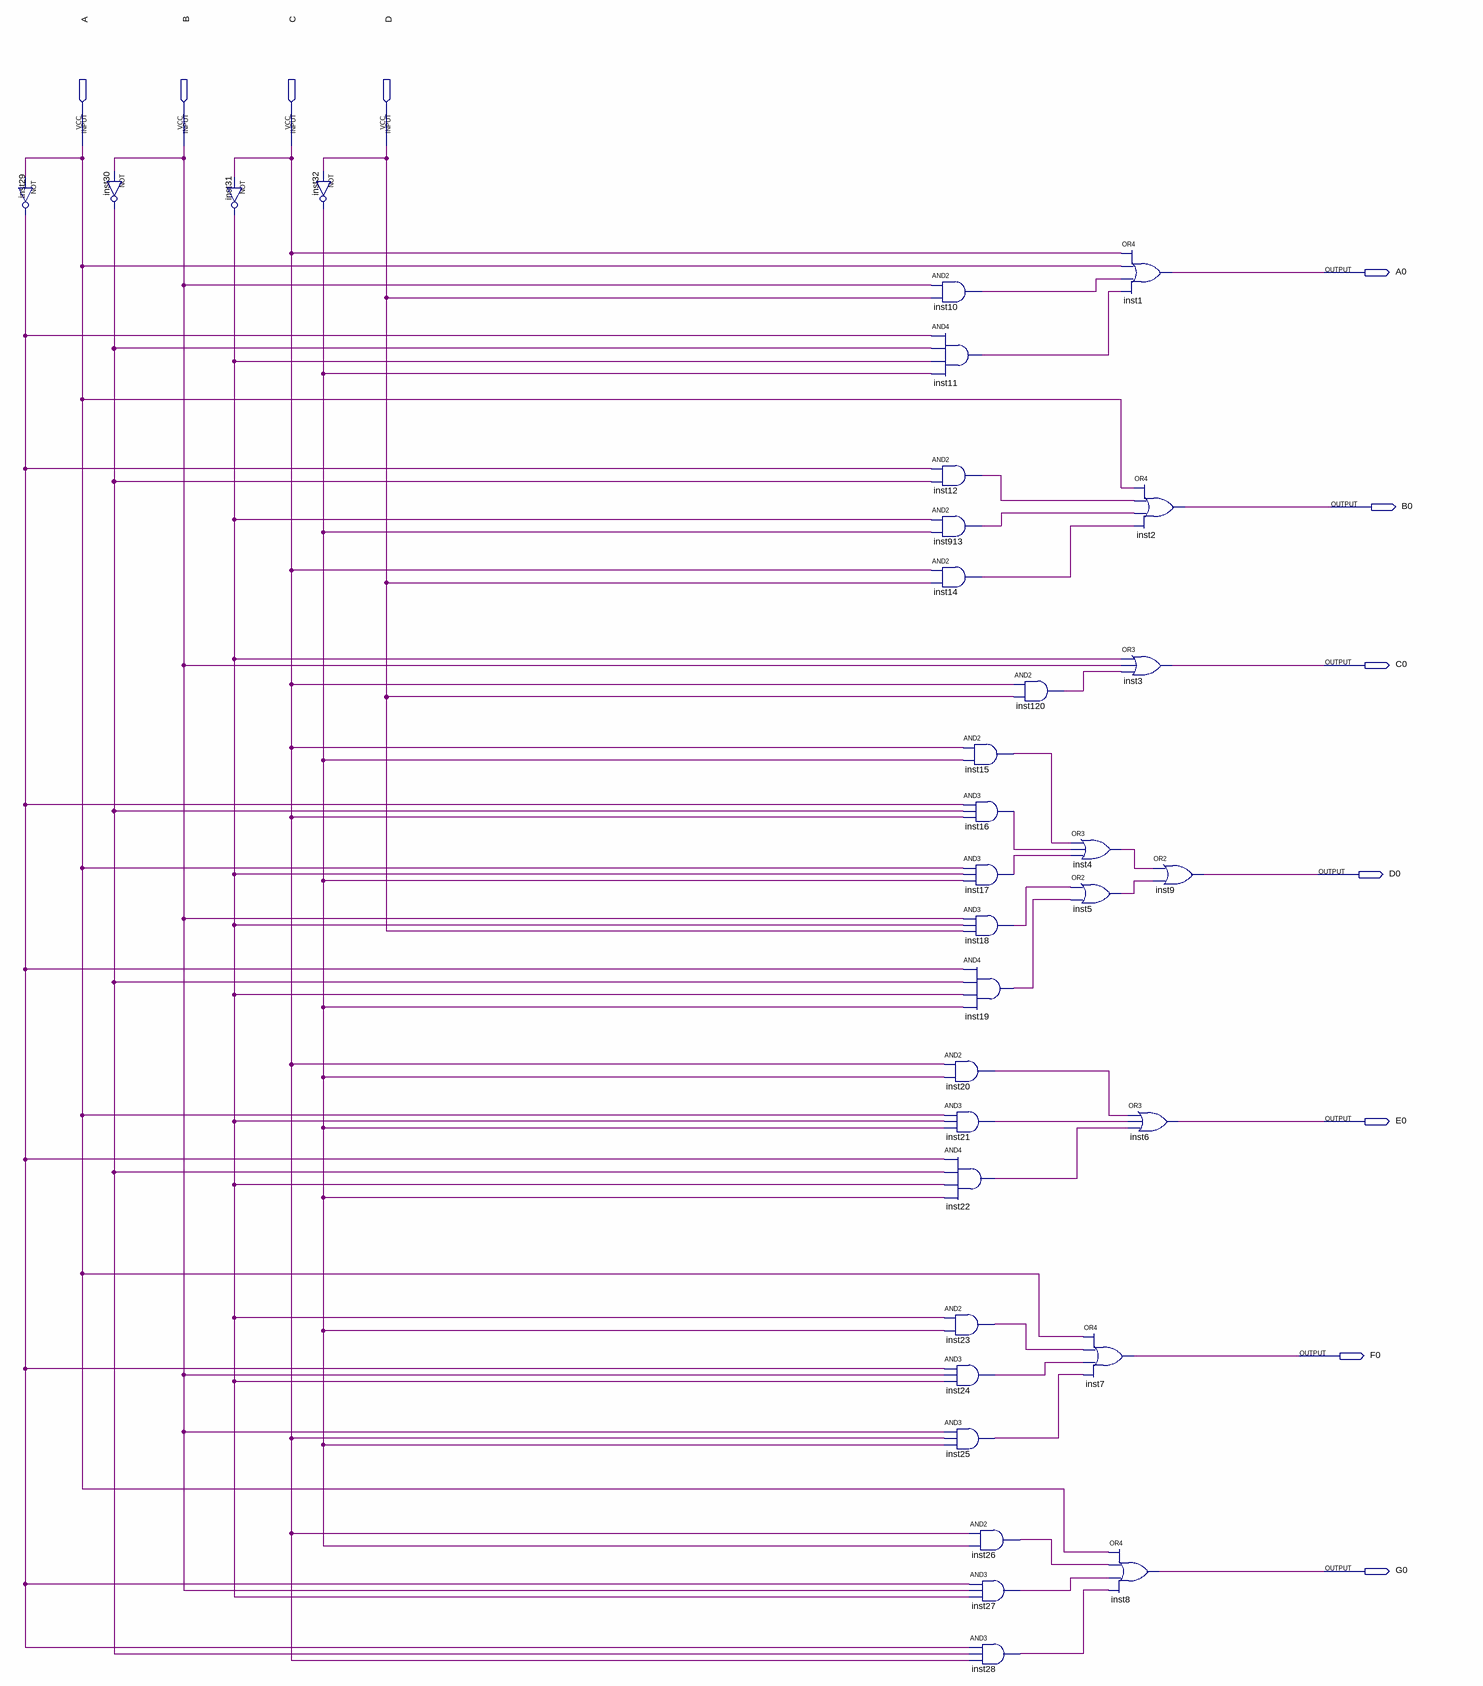
[diagram p0: schematic sheet]
// Quartus schematic Pruebas.bdf as structural Verilog: 33 symbols, 11 pins
module Pruebas (
  input  A,
  input  B,
  input  C,
  input  D,
  output A0,
  output B0,
  output C0,
  output D0,
  output E0,
  output F0,
  output G0
);

  wire inst4_out, inst5_out, inst10_out, inst11_out, inst12_out, inst14_out, inst15_out, inst16_out,
       inst17_out, inst18_out, inst19_out, inst20_out, inst21_out, inst22_out, inst23_out, inst24_out,
       inst25_out, inst26_out, inst27_out, inst28_out, inst29_out, inst30_out, inst31_out, inst32_out,
       inst120_out, inst913_out;

  not inst29 (inst29_out, A);
  not inst30 (inst30_out, B);
  not inst31 (inst31_out, C);
  not inst32 (inst32_out, D);
  and inst10 (inst10_out, B, D);
  and inst11 (inst11_out, inst29_out, inst30_out, inst31_out, inst32_out);
  and inst12 (inst12_out, inst29_out, inst30_out);
  and inst913 (inst913_out, inst31_out, inst32_out);
  and inst14 (inst14_out, C, D);
  and inst15 (inst15_out, C, inst32_out);
  and inst16 (inst16_out, inst29_out, inst30_out, C);
  and inst17 (inst17_out, A, inst31_out, inst32_out);
  and inst18 (inst18_out, B, inst31_out, D);
  and inst19 (inst19_out, inst29_out, inst30_out, inst31_out, inst32_out);
  and inst20 (inst20_out, C, inst32_out);
  and inst21 (inst21_out, A, inst31_out, inst32_out);
  and inst22 (inst22_out, inst29_out, inst30_out, inst31_out, inst32_out);
  and inst23 (inst23_out, inst31_out, inst32_out);
  and inst24 (inst24_out, inst29_out, B, inst31_out);
  and inst25 (inst25_out, B, C, inst32_out);
  and inst26 (inst26_out, C, inst32_out);
  and inst27 (inst27_out, inst29_out, B, inst31_out);
  and inst28 (inst28_out, inst29_out, inst30_out, C);
  and inst120 (inst120_out, C, D);
  or inst4 (inst4_out, inst15_out, inst16_out, inst17_out);
  or inst5 (inst5_out, inst18_out, inst19_out);
  or inst7 (F0, A, inst23_out, inst24_out, inst25_out);
  or inst1 (A0, C, A, inst10_out, inst11_out);
  or inst2 (B0, A, inst12_out, inst913_out, inst14_out);
  or inst3 (C0, inst31_out, B, inst120_out);
  or inst6 (E0, inst20_out, inst21_out, inst22_out);
  or inst8 (G0, A, inst26_out, inst27_out, inst28_out);
  or inst9 (D0, inst4_out, inst5_out);
endmodule
